# Altium schematic sheet Schemat_blokowy.SchDoc: Płytka rozwojowa STM
size A4; Author1: Łukasz Wawrzyniak; Organization: Politechnika Łódzka; Address1: WEEIA; Address2: Elektronika i Telekomunikacja; Address3: Semestr zimowy 2021/2022; Address4: Stopień II; Revision: -; SheetNumber: 1; SheetTotal: 7; Author2: Mateusz Melka; Title2: Zaawansowane narzędzia CAD/EDA; Author5: Maciej Figiel; Author4: Michał Skurpel; Author3: Jakub Korzeniowski; Index1: 239499; Index2: 239488; Index3: 239436; Index4: 239457; Index5: 239473
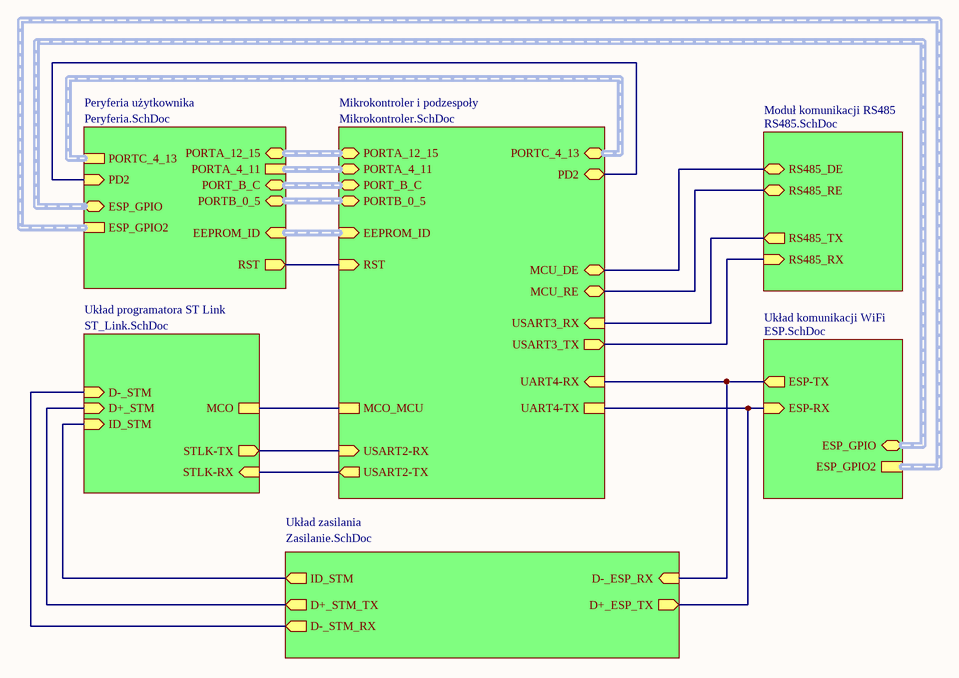
[diagram p0: Schemat_blokowy.SchDoc]

## Sub-sheets
Mikrokontroler i podzespoły = Mikrokontroler.SchDoc: UART4-RX (in), USART2-RX (in), USART2-TX (out), MCO_MCU, USART3_RX (in), USART3_TX (out), MCU_RE (bidir), MCU_DE (bidir), PD2 (bidir), RST (in), UART4-TX, PORTA_4_11 (bidir, harness PORTA 4 11), PORTA_12_15 (bidir, harness PORTA 12 15), PORTC_4_13 (bidir, harness PORTC 4 13), PORT_B_C (bidir, harness PORT_B_C), EEPROM_ID (in, harness Wyprowadzenia adresowe EEPROM), PORTB_0_5 (bidir, harness PORTB 0 5)
Moduł komunikacji RS485 = RS485.SchDoc: RS485_TX (out), RS485_RX (in), RS485_DE (bidir), RS485_RE (bidir)
Peryferia użytkownika = Peryferia.SchDoc: RST (out), PD2 (in), ESP_GPIO (bidir, harness GPIO ESP), PORTB_0_5 (bidir, harness PORTB 0 5), PORT_B_C (bidir, harness PORT_B_C), PORTA_12_15 (bidir, harness PORTA 12 15), EEPROM_ID (in, harness Wyprowadzenia adresowe EEPROM), PORTA_4_11 (harness PORTA 4 11), PORTC_4_13 (harness PORTC 4 13), ESP_GPIO2 (harness GPIO ESP2)
Układ komunikacji WiFi = ESP.SchDoc: ESP-TX (out), ESP-RX (in), ESP_GPIO (bidir, harness GPIO ESP), ESP_GPIO2 (harness GPIO ESP2)
Układ programatora ST Link = ST_Link.SchDoc: D-_STM (in), D+_STM (in), ID_STM (in), MCO, STLK-TX (out), STLK-RX (in)
Układ zasilania = Zasilanie.SchDoc: ID_STM (out), D+_STM_TX (out), D-_STM_RX (out), D+_ESP_TX (out), D-_ESP_RX (in)

## Nets
(unnamed): sheet Mikrokontroler i podzespoły/UART4-RX, sheet Układ zasilania/D-_ESP_RX, sheet Układ komunikacji WiFi/ESP-TX
(unnamed): sheet Mikrokontroler i podzespoły/USART2-RX, sheet Układ programatora ST Link/STLK-TX
(unnamed): sheet Mikrokontroler i podzespoły/USART2-TX, sheet Układ programatora ST Link/STLK-RX
(unnamed): sheet Mikrokontroler i podzespoły/MCO_MCU, sheet Układ programatora ST Link/MCO
(unnamed): sheet Mikrokontroler i podzespoły/USART3_RX, sheet Moduł komunikacji RS485/RS485_TX
(unnamed): sheet Mikrokontroler i podzespoły/USART3_TX, sheet Moduł komunikacji RS485/RS485_RX
(unnamed): sheet Mikrokontroler i podzespoły/MCU_RE, sheet Moduł komunikacji RS485/RS485_RE
(unnamed): sheet Mikrokontroler i podzespoły/MCU_DE, sheet Moduł komunikacji RS485/RS485_DE
(unnamed): sheet Mikrokontroler i podzespoły/PD2, sheet Peryferia użytkownika/PD2
(unnamed): sheet Mikrokontroler i podzespoły/RST, sheet Peryferia użytkownika/RST
(unnamed): sheet Mikrokontroler i podzespoły/UART4-TX, sheet Układ zasilania/D+_ESP_TX, sheet Układ komunikacji WiFi/ESP-RX
(unnamed): sheet Układ zasilania/ID_STM, sheet Układ programatora ST Link/ID_STM
(unnamed): sheet Układ zasilania/D+_STM_TX, sheet Układ programatora ST Link/D+_STM
(unnamed): sheet Układ zasilania/D-_STM_RX, sheet Układ programatora ST Link/D-_STM

## Buses and harness runs
harness sheet Mikrokontroler i podzespoły/EEPROM_ID = sheet Peryferia użytkownika/EEPROM_ID
harness sheet Mikrokontroler i podzespoły/PORT_B_C = sheet Peryferia użytkownika/PORT_B_C
harness sheet Mikrokontroler i podzespoły/PORTA_4_11 = sheet Peryferia użytkownika/PORTA_4_11
harness sheet Mikrokontroler i podzespoły/PORTA_12_15 = sheet Peryferia użytkownika/PORTA_12_15
harness sheet Mikrokontroler i podzespoły/PORTB_0_5 = sheet Peryferia użytkownika/PORTB_0_5
harness sheet Mikrokontroler i podzespoły/PORTC_4_13 = sheet Peryferia użytkownika/PORTC_4_13
harness sheet Peryferia użytkownika/ESP_GPIO2 = sheet Układ komunikacji WiFi/ESP_GPIO2
harness sheet Peryferia użytkownika/ESP_GPIO = sheet Układ komunikacji WiFi/ESP_GPIO

## Notes on the sheet
- Title:
- Organisation:
- Authors:
- Size:
- Time:
- A4
- Number:
- Date:
- Revision:
- Sheet
- of
- File: